# Altium schematic sheet Interface_STM32.SchDoc
size A4; DocumentNumber: 7; SheetNumber: 6; SheetTotal: 7
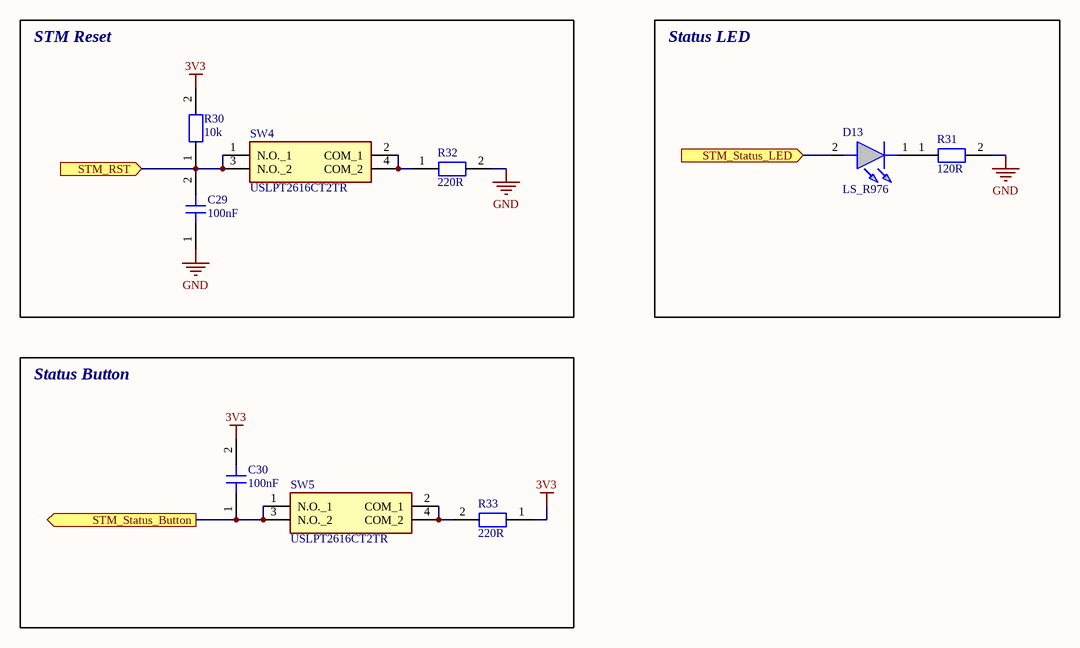
[diagram p0: Interface_STM32.SchDoc]

## Parts
C29  100nF  [Cap_0603_Medium_Density]
C30  100nF  [Cap_0603_Medium_Density]
D13  LS_R976  [LEDC2012X40N]
R30  10k  [Res_0603_Medium_Density]
R31  120R  [Res_0603_Medium_Density]
R32  220R  [Res_0603_Medium_Density]
R33  220R  [Res_0603_Medium_Density]
SW4  USLPT2616CT2TR  [USLPT2616CT2TR]
SW5  USLPT2616CT2TR  [USLPT2616CT2TR]

## Blocks framed on the sheet
STM Reset: C29 R30 R32 SW4
Status LED: D13 R31
Status Button: C30 R33 SW5

## Ports
STM_RST (in), STM_Status_Button (out), STM_Status_LED (in)

## Nets
3V3: C30.2 R30.2 R33.1
GND: C29.1 R31.2 R32.2
STM_RST: C29.2 R30.1 SW4.1(N.O._1) SW4.3(N.O._2) ; port STM_RST
STM_Status_Button: C30.1 SW5.1(N.O._1) SW5.3(N.O._2) ; port STM_Status_Button
STM_Status_LED: D13.2(A) ; port STM_Status_LED
NetD13_1: D13.1(K) R31.1
NetR32_1: R32.1 SW4.2(COM_1) SW4.4(COM_2)
NetR33_2: R33.2 SW5.2(COM_1) SW5.4(COM_2)

## Library data of the parts
C29 C30 = Capacitor_MLLC: Part Number: CC0603KRX7R8BB104; Supplier: Mouser; ComponentLink1Description: Online Store Link; ComponentLink1URL: *; Manufacturer: *; Value: 100nF; Voltage: *; Package: 0603
D13 = LS_R976: Red 0805 CHIPLED LS R976N-R102 Osram Opto LS R976, CHIPLED 0805 Series Red LED, 633 nm, 2012 (0805), Rectangle Lens SMD Package; Manufacturer_Name: ams OSRAM; Manufacturer_Part_Number: LS R976; Geometry.Height: 0.4mm; Mouser Part Number: 720-LSR976D5178; Mouser Price/Stock: https://www.mouser.co.uk/ProductDetail/OSRAM-Opto-Semiconductors/LS-R976?qs=OIr7YF%252B2cWVTfzKl425Fkw%3D%3D; Datasheet Link: http://uk.rs-online.com/web/p/products/4974804; Part Number: LS R976; Supplier: Mouser
R30 = Resistor_SMD: Part Number: CR0603AFX-1002EAS; Value: 10k; Manufacturer: *; Supplier: Mouser; Voltage: *; ComponentLink1Description: Online Store Link; ComponentLink1URL: *; Package: 0603
R31 = Resistor_SMD: Part Number: CR0603-JW-121ELF; Value: 120R; Manufacturer: *; Supplier: Mouser; Voltage: *; ComponentLink1Description: Online Store Link; ComponentLink1URL: *; Package: 0603
R32 R33 = Resistor_SMD: Part Number: CR0603-JW-221ELF; Value: 220R; Manufacturer: *; Supplier: Mouser; Voltage: *; ComponentLink1Description: Online Store Link; ComponentLink1URL: *; Package: 0603
SW4 SW5 = USLPT2616CT2TR: Body Features: Actuator Profile Extended; Manufacturer_Name: TE Connectivity; Geometry.Height: 0.55mm; Manufacturer_Part_Number: USLPT2616CT2TR; Mouser Part Number: 506-USLPT2616CT2TR; Mouser Price/Stock: https://www.mouser.co.uk/ProductDetail/TE-Connectivity-Alcoswitch/USLPT2616CT2TR?qs=qSfuJ%252Bfl%2Fd725nA8XgU6qQ%3D%3D; Datasheet Link: https://www.te.com/commerce/DocumentDelivery/DDEController?Action=srchrtrv&DocNm=2337224-1&DocType=Data%20Sheet&DocLang=English&PartCntxt=2337224-1&DocFormat=pdf; Part Number: USLPT2616CT2TR; Supplier: Mouser